# EAGLE schematic main (EAGLE 9.6.2)
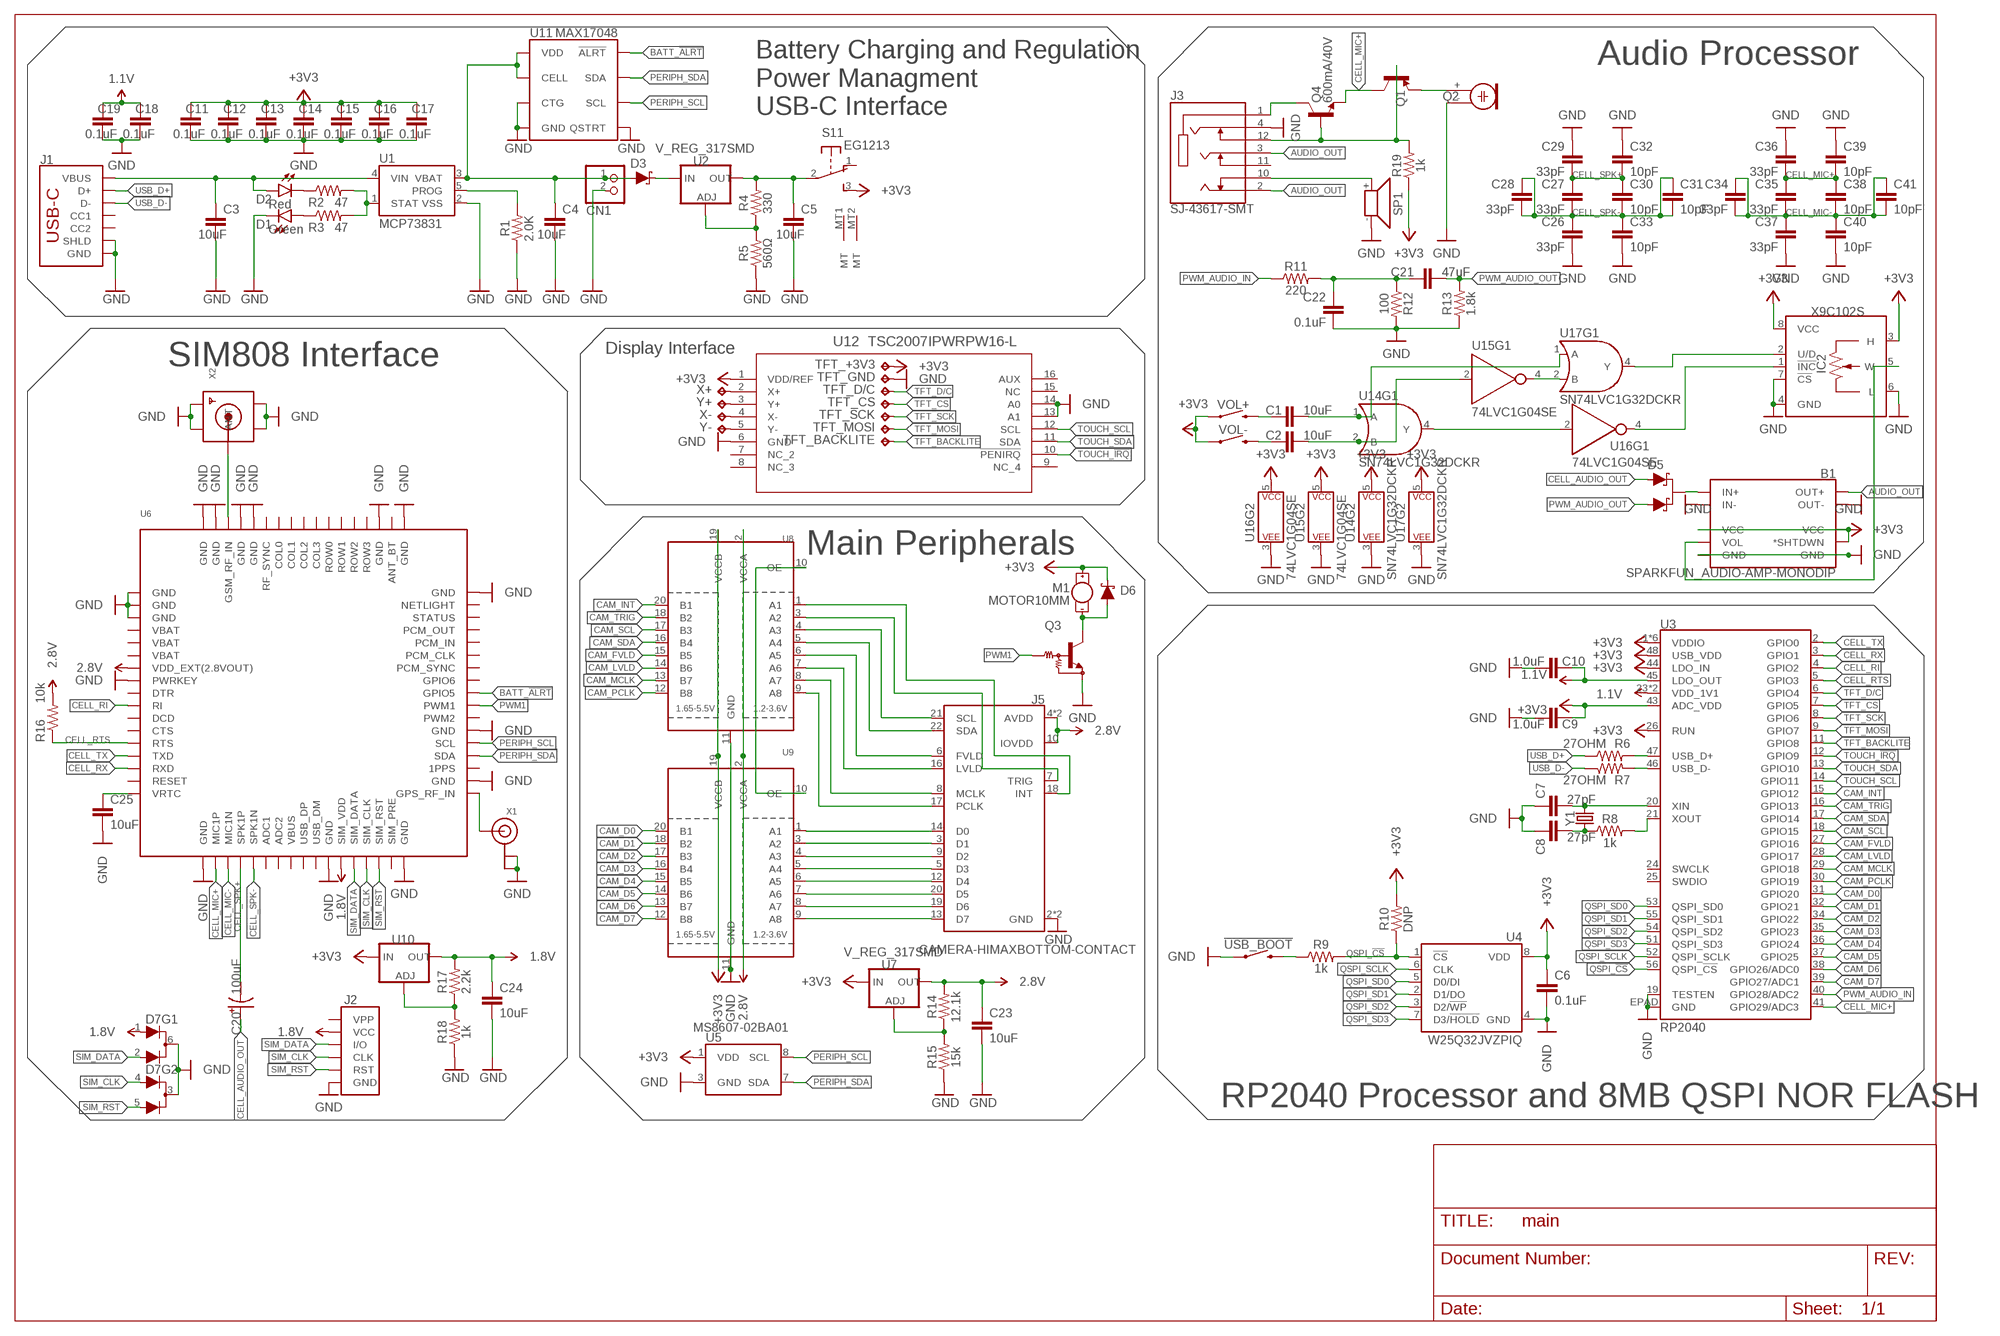
[diagram p0: schematic, sheet 1]

## Parts
!USB_BOOT  MOMENTARY-SWITCH-SPST-SMD-6.0X3.5MM  [TACTILE_SWITCH_SMD_6.0X3.5MM]
B1  SPARKFUN_AUDIO-AMP-MONODIP  [AUDIO-AMP-MONO]
C1  10uF  10UF-0402T-6.3V-20%  [0402-TIGHT]
C2  10uF  10UF-0402T-6.3V-20%  [0402-TIGHT]
C3  10uF  10UF-0402T-6.3V-20%  [0402-TIGHT]
C4  10uF  10UF-0402T-6.3V-20%  [0402-TIGHT]
C5  10uF  10UF-0402T-6.3V-20%  [0402-TIGHT]
C6  0.1uF  0.1UF-0402T-6.3V-10%-X7R  [0402-TIGHT]
C7  27pF  27PF-0402T-50V-5%  [0402-TIGHT]
C8  27pF  27PF-0402T-50V-5%  [0402-TIGHT]
C9  1.0uF  1.0UF-0402T-16V-10%  [0402-TIGHT]
C10  1.0uF  1.0UF-0402T-16V-10%  [0402-TIGHT]
C11  0.1uF  0.1UF-0402T-6.3V-10%-X7R  [0402-TIGHT]
C12  0.1uF  0.1UF-0402T-6.3V-10%-X7R  [0402-TIGHT]
C13  0.1uF  0.1UF-0402T-6.3V-10%-X7R  [0402-TIGHT]
C14  0.1uF  0.1UF-0402T-6.3V-10%-X7R  [0402-TIGHT]
C15  0.1uF  0.1UF-0402T-6.3V-10%-X7R  [0402-TIGHT]
C16  0.1uF  0.1UF-0402T-6.3V-10%-X7R  [0402-TIGHT]
C17  0.1uF  0.1UF-0402T-6.3V-10%-X7R  [0402-TIGHT]
C18  0.1uF  0.1UF-0402T-6.3V-10%-X7R  [0402-TIGHT]
C19  0.1uF  0.1UF-0402T-6.3V-10%-X7R  [0402-TIGHT]
C20  100uF  100UF-POLAR-1206-6.3V-20%(TANT)  [1206-POLAR]
C21  47uF  CAP-0402-TIGHT  [0402-TIGHT]
C22  0.1uF  0.1UF-0402T-6.3V-10%-X7R  [0402-TIGHT]
C23  10uF  10UF-0603-6.3V-20%  [0603]
C24  10uF  10UF-0402T-6.3V-20%  [0402-TIGHT]
C25  10uF  10UF-0603-6.3V-20%  [0603]
C26  33pF  33PF-0603-50V-5%  [0603]
C27  33pF  33PF-0603-50V-5%  [0603]
C28  33pF  33PF-0603-50V-5%  [0603]
C29  33pF  33PF-0603-50V-5%  [0603]
C30  10pF  10PF-0603-50V-5%  [0603]
C31  10pF  10PF-0603-50V-5%  [0603]
C32  10pF  10PF-0603-50V-5%  [0603]
C33  10pF  10PF-0603-50V-5%  [0603]
C34  33pF  33PF-0603-50V-5%  [0603]
C35  33pF  33PF-0603-50V-5%  [0603]
C36  33pF  33PF-0603-50V-5%  [0603]
C37  33pF  33PF-0603-50V-5%  [0603]
C38  10pF  10PF-0603-50V-5%  [0603]
C39  10pF  10PF-0603-50V-5%  [0603]
C40  10pF  10PF-0603-50V-5%  [0603]
C41  10pF  10PF-0603-50V-5%  [0603]
CN1  JST_2PIN-SMT-RA  [JST-PH-2-SMT-RA]
D1  Green  LED-GREEN-0603-WE  [LED-0603]
D2  Red  LED-RED-0603-WE  [LED-0603]
D3  3A/10V/280mV  DIODE-SCHOTTKY-BAT60A  [SOD-323]
D5  BAS70-05  DIODE-SCHOTTKY-DUAL  [SOT23-3]
D6  120mA/40V/370mV  DIODE-SCHOTTKY-RB751S40  [SOD-523]
D7  BAV70S,115  DIODE-DUAL  [SOT363]
IC2  X9C102S  [SOIC08]
J1  USB_C_2-LAYER_PADS  [USB-C-16P-2LAYER-PADS]
J2  SIMHOLDER-SIM  [SIMHOLDER]
J3  SJ-43617-SMT  [CUI_SJ-43617-SMT]
J5  CAMERA-HIMAXBOTTOM-CONTACT  [FPC-24-AMPHENOL-SFV24R-1STE1HLF]
M1  MOTOR10MM  [VIBE-MOTOR-10MM]
Q1  600mA/40V  TRANS_PNP-MMBT4403  [SOT23-3]
Q2  ELECTRET  [9.7ELECTRET]
Q3  TRANSISTOR-NPN_MUN2211  [TRANSISTOR-NPN_SC59-BEC]
Q4  600mA/40V  TRANS_NPN-MMBT2222AL  [SOT23-3]
R1  2.0K  2.0KOHM-0402T-1/16W-1%  [0402-TIGHT]
R2  47  47OHM-0402-TIGHT-1/16W-1%  [0402-TIGHT]
R3  47  47OHM-0402-TIGHT-1/16W-1%  [0402-TIGHT]
R4  330  330OHM-0402T-1/16W-5%  [0402-TIGHT]
R5  560Ω  560OHM_0402_TIGHT  [0402-TIGHT]
R6  27OHM  [0402-TIGHT]
R7  27OHM  [0402-TIGHT]
R8  1k  1KOHM-0402T-1/16W-1%  [0402-TIGHT]
R9  1k  1KOHM-0402T-1/16W-1%  [0402-TIGHT]
R10  DNP  DNP-0402T  [0402-TIGHT]
R11  220  220OHM-0402-TIGHT-1/16W-1%  [0402-TIGHT]
R12  100  100OHM-0402-TIGHT-1/16W-1%  [0402-TIGHT]
R13  1.8k  1.8KOHM-0603-1/10W-1%  [0603]
R14  12.1k  12.1KOHM-0603-1/10W-1%  [0603]
R15  15k  15KOHM-0603-1/10W-1%  [0603]
R16  10k  10KOHM-0402T-1/16W-1%  [0402-TIGHT]
R17  2.2k  2.2KOHM-0402T-1/16W-1%  [0402-TIGHT]
R18  1k  1KOHM-0402T-1/16W-1%  [0402-TIGHT]
R19  1k  1KOHM-0402T-1/16W-1%  [0402-TIGHT]
S1  EG1213  [EG1213]
SP1  SMS-1308MS-2-R  [SMS-1308MS-2-R]
TFT_+3V3  TPTP10R  [TP10R]
TFT_BACKLITE  TPTP10R  [TP10R]
TFT_CS  TPTP10R  [TP10R]
TFT_D/C  TPTP10R  [TP10R]
TFT_GND  TPTP10R  [TP10R]
TFT_MOSI  TPTP10R  [TP10R]
TFT_SCK  TPTP10R  [TP10R]
U1  MCP73831  [SOT23-5]
U2  V_REG_317SMD  [SOT223]
U3  RP2040  [QFN-56]
U4  W25Q32JVZPIQ  W25QXX32MBIT-6X5  [WSON-8-6X5]
U5  MS8607-02BA01  [MS8607-02BA01]
U6  GSM_SIM808_LITERAL  [SIM900_SMT]
U7  V_REG_317SMD  [SOT223]
U8  TXB0108PWR  [TSSOP20]
U9  TXB0108PWR  [TSSOP20]
U10  V_REG_317SMD  [SOT223]
U11  MAX17048  MAX17048DFN8  [DFN-8]
U12  TSC2007IPWRPW16-L  [PW16-L]
U14  SN74LVC1G32DCKR  7432  [SOT353]
U15  74LVC1G04SE  [SOT353]
U16  74LVC1G04SE  [SOT353]
U17  SN74LVC1G32DCKR  7432  [SOT353]
VOL+  MOMENTARY-SWITCH-SPST-PTH-RIGHT-ANGLE-8-020  [TACTILE_SWITCH_PTH_RA_8-020]
VOL-  MOMENTARY-SWITCH-SPST-PTH-RIGHT-ANGLE-8-020  [TACTILE_SWITCH_PTH_RA_8-020]
X1  ANTENNA_U.FL  [U.FL]
X2  SMACONNECTOR_EDGE  [SMA_EDGELAUNCH]
X+  TPTP10R  [TP10R]
X-  TPTP10R  [TP10R]
Y1  CRYSTAL-12MHZ  [CRYSTAL-SMD-2X2.5MM]
Y+  TPTP10R  [TP10R]
Y-  TPTP10R  [TP10R]

## Nets
1.1V: C10.1 C18.1 C19.1 U3.23(VDD_1V1) U3.45(LDO_OUT) U3.50(VDD_1V1)
1.8V: C24.1 D7.1(A1) J2.C1(VCC) R17.2 U6.P$29(SIM_VDD) U10.2(OUT)
2.8V: C23.1 J5.4(AVDD) J5.10(IOVDD) J5.11(AVDD) R14.2 R16.2 U6.P$7(VDD_EXT(2.8VOUT)) U7.2(OUT) U8.2(VCCA) U9.2(VCCA)
+3V3: B1.PWR+(VCC) B1.S(*SHTDWN) B1.VOL+(VCC) C6.1 C9.1 C11.1 C12.1 C13.1 C14.1 C15.1 C16.1 C17.1 D6.C IC2.3(H) IC2.8(VCC) M1.+ R10.2 R19.1 S1.3(1:S) TFT_+3V3.TP U3.1(VDDIO) U3.10(VDDIO) U3.22(VDDIO) U3.26(RUN) U3.33(VDDIO) U3.42(VDDIO) U3.43(ADC_VDD) U3.44(LDO_IN) U3.48(USB_VDD) U3.49(VDDIO) U4.8(VDD) U5.1(VDD) U7.3(IN) U8.19(VCCB) U9.19(VCCB) U10.3(IN) U12.1(VDD/REF) U14.5(P$V+) U15.5(P$V+) U16.5(P$V+) U17.5(P$V+) VOL+.1 VOL-.1
AUDIO_OUT: B1.OUT+ J3.2 J3.3
BATT_!ALRT: U6.P$43(GPIO5) U11.5(!ALRT)
CAM_D0: U3.31(GPIO20) U9.20(B1)
CAM_D1: U3.32(GPIO21) U9.18(B2)
CAM_D2: U3.34(GPIO22) U9.17(B3)
CAM_D3: U3.35(GPIO23) U9.16(B4)
CAM_D4: U3.36(GPIO24) U9.15(B5)
CAM_D5: U3.37(GPIO25) U9.14(B6)
CAM_D6: U3.38(GPIO26/ADC0) U9.13(B7)
CAM_D7: U3.39(GPIO27/ADC1) U9.12(B8)
CAM_FVLD: U3.27(GPIO16) U8.15(B5)
CAM_INT: U3.15(GPIO12) U8.20(B1)
CAM_LVLD: U3.28(GPIO17) U8.14(B6)
CAM_MCLK: U3.29(GPIO18) U8.13(B7)
CAM_PCLK: U3.30(GPIO19) U8.12(B8)
CAM_SCL: U3.18(GPIO15) U8.17(B3)
CAM_SDA: U3.17(GPIO14) U8.16(B4)
CAM_TRIG: U3.16(GPIO13) U8.18(B2)
CELL_AUDIO_OUT: C20.1(+) D5.1(A)
CELL_MIC+: C35.1 C36.2 C38.1 C39.2 Q1.3(C) Q4.2(E) U3.41(GPIO29/ADC3) U6.P$19(MIC1P)
CELL_MIC-: C34.1 C34.2 C35.2 C37.1 C38.2 C40.1 C41.1 C41.2 U6.P$20(MIC1N)
CELL_RI: U3.4(GPIO2) U6.P$10(RI)
CELL_RTS: R16.1 U3.5(GPIO3) U6.P$13(RTS)
CELL_RX: U3.3(GPIO1) U6.P$15(RXD)
CELL_SPK+: C20.2(-) C27.1 C29.2 C30.1 C32.2 U6.P$21(SPK1P)
CELL_SPK-: C26.1 C27.2 C28.1 C28.2 C30.2 C31.1 C31.2 C33.1 U6.P$22(SPK1N)
CELL_TX: U3.2(GPIO0) U6.P$14(TXD)
GND: !USB_BOOT.1 B1.IN- B1.OUT- B1.PWR-(GND) B1.VOL-(GND) C3.2 C4.2 C5.2 C6.2 C7.1 C8.1 C9.2 C10.2 C11.2 C12.2 C13.2 C14.2 C15.2 C16.2 C17.2 C18.2 C19.2 C22.2 C23.2 C24.2 C25.2 C26.2 C29.1 C32.1 C33.2 C36.1 C37.2 C39.1 C40.2 CN1.2 D1.C D7.3(C) D7.6(C) IC2.4(GND) IC2.6(L) IC2.7(!CS) J1.GND J1.GND2(GND) J1.SHLD1(SHLD) J1.SHLD2(SHLD) J1.SHLD3(SHLD) J1.SHLD4(SHLD) J2.C5(GND) J3.4 J5.2(GND) J5.15(GND) Q2.- Q3.E R1.1 R5.1 R12.2 R13.1 R15.1 R18.1 SP1.- TFT_GND.TP U1.2(VSS) U3.19(TESTEN) U3.EPAD(GND) U4.4(GND) U5.3(GND) U6.P$1(GND) U6.P$2(GND) U6.P$3(GND) U6.P$8(PWRKEY) U6.P$18(GND) U6.P$28(GND) U6.P$34(GND) U6.P$36(GND) U6.P$40(GND) U6.P$51(GND) U6.P$52(GND) U6.P$54(GND) U6.P$64(GND) U6.P$65(GND) U6.P$67(GND) U6.P$68(GND) U8.11(GND) U9.11(GND) U11.1(CTG) U11.4(GND) U11.6(QSTRT) U11.9(GND) U12.6(GND) U12.13(A1) U12.14(A0) U14.3(P$V-) U15.3(P$V-) U16.3(P$V-) U17.3(P$V-) X1.1(GND) X1.2(GND) X2.GND@1(GND4) X2.GND@2(GND3) X2.GND@3(GND2) X2.GND@4(GND1)
N$1: C5.1 R4.2 S1.2(1:P) U2.2(OUT)
N$2: C1.2 U14.1(A) U17.1(A)
N$3: C2.2 U14.2(B) U15.2(A)
N$4: C3.1 D2.A J1.VBUS1(VBUS) J1.VBUS2(VBUS) U1.4(VIN)
N$5: R2.2 R3.2 U1.1(STAT)
N$6: D2.C R2.1
N$7: D1.A R3.1
N$8: R1.2 U1.5(PROG)
N$9: U15.4(Y) U17.2(B)
N$10: D3.C U2.3(IN)
N$11: R4.1 R5.2 U2.1(ADJ)
N$12: C1.1 VOL+.2
N$13: U14.4(Y) U16.2(A)
N$14: R6.2 U3.47(USB_D+)
N$15: R7.2 U3.46(USB_D-)
N$16: R8.2 U3.21(XOUT)
N$17: C7.2 U3.20(XIN) Y1.P3
N$18: C8.2 R8.1 Y1.P1
N$19: !USB_BOOT.2 R9.1
N$20: J5.14(D0) U9.1(A1)
N$21: J5.3(D1) U9.3(A2)
N$22: J3.10 SP1.+
N$23: C21.1 C22.1 R11.2 R12.1
N$24: B1.IN+ D5.3(C)
N$25: R14.1 R15.2 U7.1(ADJ)
N$26: J5.9(D2) U9.4(A3)
N$27: U8.10(OE) U9.10(OE)
N$28: J5.5(D3) U9.5(A4)
N$29: J5.20(D5) U9.7(A6)
N$30: J5.12(D4) U9.6(A5)
N$31: J5.19(D6) U9.8(A7)
N$32: J5.13(D7) U9.9(A8)
N$33: J5.17(PCLK) U8.9(A8)
N$34: J5.8(MCLK) U8.8(A7)
N$35: J5.16(LVLD) U8.7(A6)
N$36: J5.6(FVLD) U8.6(A5)
N$37: J5.22(SDA) U8.5(A4)
N$38: J5.21(SCL) U8.4(A3)
N$39: J5.7(TRIG) U8.3(A2)
N$40: J5.18(INT) U8.1(A1)
N$41: U6.P$35(GPS_RF_IN) X1.3(SIGNAL)
N$42: D6.A M1.- Q3.C
N$43: C4.1 CN1.1 D3.A U1.3(VBAT) U11.2(CELL) U11.3(VDD)
N$44: IC2.2(U/D) U17.4(Y)
N$45: U6.P$66(GSM_RF_IN) X2.P(ANT)
N$46: R17.1 R18.2 U10.1(ADJ)
N$47: C25.1 U6.P$17(VRTC)
N$48: Q1.2(E) Q2.+
N$49: IC2.1(!INC) U16.4(Y)
N$50: C2.1 VOL-.2
N$51: B1.VOL IC2.5(W)
N$52: U12.2(X+) X+.TP
N$53: U12.3(Y+) Y+.TP
N$54: U12.4(X-) X-.TP
N$55: U12.5(Y-) Y-.TP
N$56: J3.12 Q1.1(B) Q4.1(B) R19.2
N$57: J3.1 Q4.3(C)
PERIPH_SCL: U5.8(SCL) U6.P$39(SCL) U11.7(SCL)
PERIPH_SDA: U5.7(SDA) U6.P$38(SDA) U11.8(SDA)
PWM1: Q3.B U6.P$42(PWM1)
PWM_AUDIO_IN: R11.1 U3.40(GPIO28/ADC2)
PWM_AUDIO_OUT: C21.2 D5.2(A1) R13.2
QSPI_!CS: R9.2 R10.1 U3.56(QSPI_!CS!) U4.1(!CS!)
QSPI_SCLK: U3.52(QSPI_SCLK) U4.6(CLK)
QSPI_SD0: U3.53(QSPI_SD0) U4.5(D0/DI)
QSPI_SD1: U3.55(QSPI_SD1) U4.2(D1/DO)
QSPI_SD2: U3.54(QSPI_SD2) U4.3(D2/!WP!)
QSPI_SD3: U3.51(QSPI_SD3) U4.7(D3/!HOLD!)
SIM_CLK: D7.4(A1) J2.C3(CLK) U6.P$31(SIM_CLK)
SIM_DATA: D7.2(A2) J2.C7(I/O) U6.P$30(SIM_DATA)
SIM_RST: D7.5(A2) J2.C2(RST) U6.P$32(SIM_RST)
TFT_BACKLITE: TFT_BACKLITE.TP U3.11(GPIO8)
TFT_CS: TFT_CS.TP U3.7(GPIO5)
TFT_D/C: TFT_D/C.TP U3.6(GPIO4)
TFT_MOSI: TFT_MOSI.TP U3.9(GPIO7)
TFT_SCK: TFT_SCK.TP U3.8(GPIO6)
TOUCH_!IRQ: U3.12(GPIO9) U12.10(!PENIRQ)
TOUCH_SCL: U3.14(GPIO11) U12.12(SCL)
TOUCH_SDA: U3.13(GPIO10) U12.11(SDA)
USB_D+: J1.A6(D+) J1.B6(D+) R6.1
USB_D-: J1.A7(D-) J1.B7(D-) R7.1
Unconnected: J1.A5(CC1) J1.B5(CC2) J2.C6(VPP) J3.11 J5.MNT1@0(MNT1) J5.MNT1@1(MNT1) J5.MNT2@0(MNT2) J5.MNT2@1(MNT2) S1.1(1:O) S1.MT1(MT) S1.MT2(MT) U3.24(SWCLK) U3.25(SWDIO) U6.P$9(DTR) U6.P$11(DCD) U6.P$12(CTS) U6.P$16(RESET) U6.P$23(ADC1) U6.P$24(ADC2) U6.P$26(USB_DP) U6.P$27(USB_DM) U6.P$33(SIM_PRE) U6.P$37(1PPS) U6.P$41(PWM2) U6.P$44(GPIO6) U6.P$45(PCM_SYNC) U6.P$46(PCM_CLK) U6.P$47(PCM_IN) U6.P$48(PCM_OUT) U6.P$49(STATUS) U6.P$50(NETLIGHT) U6.P$53(ANT_BT) U6.P$55(ROW3) U6.P$56(ROW2) U6.P$57(ROW1) U6.P$58(ROW0) U6.P$59(COL3) U6.P$60(COL2) U6.P$61(COL1) U6.P$62(COL0) U6.P$63(RF_SYNC) U12.7(NC_2) U12.8(NC_3) U12.9(NC_4) U12.15(NC) U12.16(AUX)

## Notes on the sheet
- Audio Processor
- Battery Charging and Regulation
  Power Managment
  USB-C Interface
- SIM808 Interface
- Display Interface
- Main Peripherals
- RP2040 Processor and 8MB QSPI NOR FLASH

## Power pins joined to a net without a drawn wire
VBAT: U6.P$4(VBAT) U6.P$5(VBAT) U6.P$6(VBAT)
VBUS: U6.P$25(VBUS)

## Library data of the parts
!USB_BOOT = SparkFun-Switches:MOMENTARY-SWITCH-SPST: Momentary Switch (Pushbutton) - SPST Normally-open (NO) SPST momentary switches (buttons, pushbuttons). Variants PTH-12MM - 12mm square, through-hole Momentary Pushbutton Switch - 12mm Square <https://www.sparkfun.com/products/9190> (COM-09190) PTH-6.0MM, PTH-6.0MM-KIT - 6.0mm square, through-hole Mini Pushbutton Switch <https://www.sparkfun.com/products/97> (COM-00097) KIT package intended for soldering kit's - only one side of pads' copper is exposed. PTH-RIGHT-ANGLE-KIT - Right-angle, through-hole Right Angle Tactile Button <https://www.sparkfun.com/products/10791> - Used on SparkFun BigTime Watch Kit <https://www.sparkfun.com/products/11734> SMD-12MM - 12mm square, surface-mount Tactile Button - SMD (12mm) <https://www.sparkfun.com/products/12993> (COM-12993) Used on SparkFun PicoBoard <https://www.sparkfun.com/products/11888> SMD-4.5MM - 4.5mm Square Trackball Switch Used on SparkFun Blackberry Trackballer Breakout <https://www.sparkfun.com/products/13169> SMD-4.6MMX2.8MM - 4.60mm x 2.80mm, surface mount Used on SparkFun Pro Micro - RP2040 <https://www.sparkfun.com/products/17717> SMD-5.2MM, SMD-5.2-REDUNDANT - 5.2mm square, surface-mount Mini Pushbutton Switch - SMD <https://www.sparkfun.com/products/8720> (COM-08720) Used on Arduino Pro Mini <https://www.sparkfun.com/products/11114> REDUNDANT package connects both switch circuits together SMD-6.0X3.5MM - 6.0 x 3.5mm, surface mount Momentary Reset Switch SMD <https://www.sparkfun.com/products/8229> (COM-08229) SMD-6.2MM-TALL - 6.2mm square, surface mount Tactile Button - SMD (6mm) <https://www.sparkfun.com/products/12992> Used on SparkFun Digital Sandbox <https://www.sparkfun.com/products/12651> SMD-RIGHT-ANGLE - Right-angle, surface mount Used on SparkFun Block for Intel® Edison - Arduino <https://www.sparkfun.com/products/13036>; PROD_ID: SWCH-14278; SF_SKU: COM-08229
B1 = SparkFun-Boards:SPARKFUN_AUDIO-AMP-MONO: SparkFun Mono Audio Amp Breakout- TPA2005D1 This tiny audio amplifier is based on the Texas Instruments TPA2005D1. Its efficient class-D operation means low heat and long battery life. It can drive an 8-Ohm speaker at up to 1.4 Watts SparkFun Products: Mono Audio Amp Breakout <https://www.sparkfun.com/products/11044>
C1-C5 C24 = SparkFun-Capacitors:10UF: 10.0µF ceramic capacitors A capacitor is a passive two-terminal electrical component used to store electrical energy temporarily in an electric field.; PROD_ID: CAP-14848
C6 C11-C19 C22 = SparkFun-Capacitors:0.1UF: 0.1µF ceramic capacitors A capacitor is a passive two-terminal electrical component used to store electrical energy temporarily in an electric field.; PROD_ID: CAP-14993
C7 C8 = SparkFun-Capacitors:27PF: 27pF ceramic capacitors A capacitor is a passive two-terminal electrical component used to store electrical energy temporarily in an electric field.; PROD_ID: CAP-15357
C9 C10 = SparkFun-Capacitors:1.0UF: 1µF ceramic capacitors A capacitor is a passive two-terminal electrical component used to store electrical energy temporarily in an electric field.; PROD_ID: CAP-12417
C20 = SparkFun-Capacitors:100UF-POLAR: 100µF polarized capacitors A capacitor is a passive two-terminal electrical component used to store electrical energy temporarily in an electric field.; PROD_ID: CAP-14093
C21 = SparkFun-Capacitors:CAP
C23 C25 = SparkFun-Capacitors:10UF: 10.0µF ceramic capacitors A capacitor is a passive two-terminal electrical component used to store electrical energy temporarily in an electric field.; PROD_ID: CAP-11015
C26-C29 C34-C37 = SparkFun-Capacitors:33PF: 33pF ceramic capacitors A capacitor is a passive two-terminal electrical component used to store electrical energy temporarily in an electric field.; PROD_ID: CAP-10142
C30-C33 C38-C41 = SparkFun-Capacitors:10PF: 10pF ceramic capacitors A capacitor is a passive two-terminal electrical component used to store electrical energy temporarily in an electric field.; PROD_ID: CAP-11812
CN1 = adafruit:JST_2PIN: JST 2-Pin Connectors of various flavors SMT-RA (S2B-PH-SM4) 4UConnector #17311 SMT (B2B-PH-SM4) THM-RA (S2B-PH) THM (B2B-PH)
D1 = SparkFun-LED:LED-GREEN: Green SMD LED Used in manufacturing of various products at SparkFun Packages: 0603 - SMD 0603 package [Product Link] <http://www.futureelectronics.com/en/technologies/semiconductors/optoelectronics/leds/Pages/9894312-LTST-C190GKT.aspx?CrossPart=HSMG-C190&IM=0> LilyPad 1206 - SMD1206 LilyPad package [Product Link] <http://www.futureelectronics.com/en/Technologies/Product.aspx?ProductID=IN150NGHARVATEKCORPORATION2049943&IM=0> 1206 - SMD1206 package [Product Link] <http://www.futureelectronics.com/en/technologies/semiconductors/optoelectronics/leds/Pages/8315665-LTST-C150KGKT.aspx?IM=0> 1206 Bottom Mount -SMD 1206 Bottom Mount [Product Link] <http://www.digikey.com/product-detail/en/lite-on-inc/LTST-C230KGKT/160-1456-1-ND/386854> SparkFun Products: Pro Mini 328 -5V <https://www.sparkfun.com/products/821> RedBoard <https://www.sparkfun.com/products/12757> MP3 Trigger <https://www.sparkfun.com/products/13720> Makey Makey <https://www.sparkfun.com/products/11076>; PROD_ID: DIO-16512
D2 = SparkFun-LED:LED-RED: Red SMD LED Used in manufacturing of most products at SparkFun Packages: 0603 - KB - KingBright (DIO-17976) SMD 0603 package [Datasheet] <https://www.kingbrightusa.com/images/catalog/SPEC/APT1608SURCK.pdf> 0603 - (DIO-00819, has gone EOL) SMD 0603 package 0603 SMART - SMD 0603 SMART package ( more efficient and expensive)[Product Link] <http://www.osram-os.com/Graphics/XPic2/00077099_0.pdf> 1206 - SMD1206 package [Product Link] <https://www.sparkfun.com/datasheets/DevTools/LilyPad/Q150OVS4.pdff> SparkFun Products: Pro Mini 328 -5V <https://www.sparkfun.com/products/821> RedBoard <https://www.sparkfun.com/products/12757> IOIO-OTG <https://www.sparkfun.com/products/13613>; PROD_ID: DIO-16511
D3 = SparkFun-DiscreteSemi:DIODE-SCHOTTKY: Schottky diode A Schottky diode is a semiconductor diode which has a low forward voltage drop and a very fast switching action.; PROD_ID: DIO-14072
D5 = SparkFun-DiscreteSemi:DIODE-SCHOTTKY-DUAL: Diodes Incorporated - BAS70-05 Dual Schottky Diode Two Schottky Diodes in a single SOT-23 package. Low reverse current (100 nA) Vf: Datasheet referenced for footprint <https://www.diodes.com/assets/Datasheets/ds11007.pdf>; PROD_ID: DIO-14829
D6 = SparkFun-DiscreteSemi:DIODE-SCHOTTKY: Schottky diode A Schottky diode is a semiconductor diode which has a low forward voltage drop and a very fast switching action.; PROD_ID: DIO-11018
D7 = SparkFun-DiscreteSemi:DIODE-DUAL; PROD_ID: DIO-15412
IC2 = pot-xicor:X9C102*: Digital POTENTIOMETER; MF: INTERSIL; MPN: X9C102SIZ; OC_FARNELL: 1562072; OC_NEWARK: 79K8947
J1 = SparkFun-Connectors:USB_C: USB Type C 16Pin Connector Super Speed pins not available on the 16-pin purely SMD connector so this part is best for USB 2.0 implementations. D1 and D2 are tied together enabling D+/- no matter which way the cable is plugged into the connector. The two channel configuration pins (CC1/2) are exposed. These are normally connected to ground via 5.1k resistors but can be reconfigured for high current/high power applications. **4-LAYER BOARD WARNING!!** If designing 4-layer board, make sure to select the variant _4-LAYER-ISOLATED. The linked footprint (USB-C-16-4LAYER-ISOLATED) includes some very necessary cutout polygons in the inner layers (2 and 15). This prevents the PTH mounting shield legs on the USB connector from electrically connecting any other polygons on the inner layers (usually VCC and GND).; PROD_ID: CONN-14122
J2 = SparkFun-Connectors:SIMHOLDER: SIM Cellular Card Socket SMT 6 pin standard connection. SparkFun Products: SIM Socket <https://www.sparkfun.com/products/548> SparkFun Cellular Shield - MG2639 <https://www.sparkfun.com/products/13120> SparkFun SIM Card Socket Breakout <https://www.sparkfun.com/products/573>; PROD_ID: CONN-08536; SF_ID: PRT-00548
J3 = SJ-43617-SMT:SJ-43617-SMT: 4 Conductor 3.5 mm Mid Mount SMT Audio Jack w/ Three Switches Check availability <https://pricing.snapeda.com/parts/SJ-43617-SMT-TR/CUI%20Devices/view-part?ref=eda>; AVAILABILITY: In Stock; CUI_PURCHASE_URL: https://www.cuidevices.com/product/interconnect/connectors/audio-connectors/jacks/sj-4361x-smt-series?utm_source=snapeda.com&utm_medium=referral&utm_campaign=snapedaBOM; DESCRIPTION: 3.5 mm, Right Angle, Mid Mount (SMT), 4 Conductors, 0~1 Internal Switches, Audio Jack Connector; MF: CUI Devices; MP: SJ-43617-SMT-TR; PACKAGE: None; PRICE: None; PURCHASE-URL: https://pricing.snapeda.com/search/part/SJ-43617-SMT-TR/?ref=eda
J5 = SparkFun-Connectors:CAMERA-HIMAX; DIGIKEY: 609-4320-2-ND; PROD_ID: CONN-14233
M1 = SparkFun-Electromechanical:MOTOR: Motor (Single-Phase) Two-terminal, single-phase motors. SparkFun Products Vibration Motor <https://www.sparkfun.com/products/8449> (ROB-08449) Physical dimension and wire connections for this powerful vibration motor. Motor has a self adhesive backing.; PROD_ID: COMP-08572; SF_SKU: ROB-08449
Q1 = SparkFun-DiscreteSemi:TRANS_PNP: PNP transistor Current controlled devices typically used to amplify current or used as a switch. SparkFun Products: SparkFun Serial Enabled 16x2 LCD - Red on Black <https://www.sparkfun.com/products/9068> SparkFun Logomatic <https://www.sparkfun.com/products/12772>; PROD_ID: TRANS-09245
Q2 = adafruit:ELECTRET: Electret microphone Thru hole 2.54mm spacing with 9.7mm diameter
Q3 = 52101-101-REV-A_v16:TRANSISTOR-NPN_MUN2211*: NPN Bias Resistor Transistor
Q4 = SparkFun-DiscreteSemi:TRANS_NPN: NPN transistor Current controlled devices typically used to amplify current or used as a switch. BC547 - COM-08928 <http://www.sparkfun.com/products/8928> (TO-92 45V 100mA) (1.Collector 2.Base 3.Emitter) 2N3904 - COM-00521 <http://www.sparkfun.com/products/521> (TO-92 40V 200mA) (1.Emitter 2.Base 3.Collector) P2N2222A - COM-12852 <http://www.sparkfun.com/products/12852> (TO-92 40V 600mA) (1.Collector 2.Base 3.Emitter); PROD_ID: TRANS-08049
R1 = SparkFun-Resistors:2.0KOHM: 2kΩ resistor A resistor is a passive two-terminal electrical component that implements electrical resistance as a circuit element. Resistors act to reduce current flow, and, at the same time, act to lower voltage levels within circuits. - Wikipedia; PROD_ID: RES-15406
R2 R3 = SparkFun-Resistors:47OHM: 47Ω resistor A resistor is a passive two-terminal electrical component that implements electrical resistance as a circuit element. Resistors act to reduce current flow, and, at the same time, act to lower voltage levels within circuits. - Wikipedia; PROD_ID: RES-15585
R4 = SparkFun-Resistors:330OHM: 330Ω resistor A resistor is a passive two-terminal electrical component that implements electrical resistance as a circuit element. Resistors act to reduce current flow, and, at the same time, act to lower voltage levels within circuits. - Wikipedia; PROD_ID: RES-15407
R5 = SparkFun-Resistors:560OHM; PROD_ID: RES-13766
R6 R7 = SparkFun-Resistors:27OHM: 27Ω resistor A resistor is a passive two-terminal electrical component that implements electrical resistance as a circuit element. Resistors act to reduce current flow, and, at the same time, act to lower voltage levels within circuits. - Wikipedia; PROD_ID: RES-15238
R8 R9 R18 R19 = SparkFun-Resistors:1KOHM: 1kΩ resistor A resistor is a passive two-terminal electrical component that implements electrical resistance as a circuit element. Resistors act to reduce current flow, and, at the same time, act to lower voltage levels within circuits. - Wikipedia; PROD_ID: RES-14342
R10 = SparkFun-Resistors:DNP: Do-Not-Populate resistor A resistor is a passive two-terminal electrical component that implements electrical resistance as a circuit element. Resistors act to reduce current flow, and, at the same time, act to lower voltage levels within circuits. - Wikipedia
R11 = SparkFun-Resistors:220OHM: 220Ω resistor A resistor is a passive two-terminal electrical component that implements electrical resistance as a circuit element. Resistors act to reduce current flow, and, at the same time, act to lower voltage levels within circuits. - Wikipedia; PROD_ID: RES-15269
R12 = SparkFun-Resistors:100OHM: 100Ω resistor A resistor is a passive two-terminal electrical component that implements electrical resistance as a circuit element. Resistors act to reduce current flow, and, at the same time, act to lower voltage levels within circuits. - Wikipedia; PROD_ID: RES-14962
R13 = SparkFun-Resistors:1.8KOHM: 1.8kΩ resistor A resistor is a passive two-terminal electrical component that implements electrical resistance as a circuit element. Resistors act to reduce current flow, and, at the same time, act to lower voltage levels within circuits. - Wikipedia; PROD_ID: RES-09119
R14 = SparkFun-Resistors:12.1KOHM: 12.1kΩ resistor A resistor is a passive two-terminal electrical component that implements electrical resistance as a circuit element. Resistors act to reduce current flow, and, at the same time, act to lower voltage levels within circuits. - Wikipedia; PROD_ID: RES-09378
R15 = SparkFun-Resistors:15KOHM: 15kΩ resistor A resistor is a passive two-terminal electrical component that implements electrical resistance as a circuit element. Resistors act to reduce current flow, and, at the same time, act to lower voltage levels within circuits. - Wikipedia; PROD_ID: RES-07854
R16 = SparkFun-Resistors:10KOHM: 10kΩ resistor A resistor is a passive two-terminal electrical component that implements electrical resistance as a circuit element. Resistors act to reduce current flow, and, at the same time, act to lower voltage levels within circuits. - Wikipedia; PROD_ID: RES-14241
R17 = SparkFun-Resistors:2.2KOHM: 2.2kΩ resistor A resistor is a passive two-terminal electrical component that implements electrical resistance as a circuit element. Resistors act to reduce current flow, and, at the same time, act to lower voltage levels within circuits. - Wikipedia; PROD_ID: RES-14341
S1 = adafruit:EG1213: E-Switch right-angle slide SPDT Part #EG1213 http://www.ladyada.net/library/eagle
SP1 = speaker:SMS-1308MS-2-R: Speaker 13 x 13mm, 8 Ohm, 0.7W Source: pui audio inc. SMS-1308MS-2-R.pdf
TFT_+3V3 TFT_BACKLITE TFT_CS TFT_D/C TFT_GND TFT_MOSI TFT_SCK X+ X- Y+ Y- = BeagleBone_Blue_R3:TP: Test pad
U1 = SparkFun-IC-Power:MCP73831: MCP73831T Li-Ion, Li-Pol Controller Miniature single cell, fully integrated Li-Ion, Li-polymer charge management controller Datasheet <http://ww1.microchip.com/downloads/en/DeviceDoc/20001984g.pdf> SparkFun Products: SparkFun ESP32 Thing <https://www.sparkfun.com/products/13907> SparkFun 9DoF Razor IMU M0 <https://www.sparkfun.com/products/14001>; PROD_ID: IC-09995
U2 U7 U10 = SparkFun-IC-Power:V_REG_317: Voltage Regulator Standard LM317 adjustable voltage regulator. AOI (Adjust Output Input). Google 'LM317 Calculator' for easy to use app to get the two resistor values needed. 240/720 for 5V output. 240/390 for 3.3V output. Spark Fun Electronics SKU : COM-00527
U3 = SparkFun-IC-Microcontroller:RP2040: Raspberry Pi RP2040 MCU 56-pin 32-bit Microcontroller with 264kB of SRAM and external flash support up to 16MB Getting Started with the RP2040 <https://pico.raspberrypi.org/getting-started/> Dual-core ARM Cortex M0+ processor, flexible clock running up to 133 MHz 264kB of SRAM, and QSPI control of common flash memory USB 1.1 Host and Device support Low-power sleep and dormant modes Drag & drop programming using mass storage over USB 26 multi-function GPIO pins 2×SPI, 2×I2C, 2×UART, 3×12-bit ADC, 16×controllable PWM channels Accurate clock and timer on-chip Temperature sensor Accelerated floating point libraries on-chip 8×Programmable IO (PIO) state machines for custom peripheral support; PROD_ID: IC-15502
U4 = SparkFun-IC-Memory:W25QXX; PROD_ID: IC-15681
U5 = SparkFun-Sensors:MS8607-02BA01: PHT Combination Sensor Source: Datasheet <http://www.te.com/commerce/DocumentDelivery/DDEController?Action=showdoc&DocId=Data SheetMS8607-02BA01BpdfEnglishENG_DS_MS8607-02BA01_B.pdfCAT-BLPS0018>; PROD_ID: IC-15048
U6 = adafruit:GSM_SIM808_LITERAL: SIM808 GSM Module
U8 U9 = adafruit:TXB0108PWR: 8-Bit Bi-Directional Level Shifter 1.2V-3.6V (VCCA) to 1.65V-5.5V (VCCB) bi-directional level shifter with auto direction sensing. Max data rate - VCCA 1.8V: 20Mbps (50ns), VCCA 3.3V: 100Mbps (10ns) Digikey: 296-21527-1-ND
U11 = SparkFun-IC-Power:MAX17048: Micropower 1-Cell Li+ ModelGauge SparkFun Products Qduino Mini <https://www.sparkfun.com/products/13614> (DEV-13614); PROD_ID: IC-12551
U12 = ultra_librarian_parts:TSC2007IPWR; COPYRIGHT: Copyright (C) 2023 Ultra Librarian. All rights reserved.; MANUFACTURER_PART_NUMBER: TSC2007IPWR; MFR_NAME: Texas Instruments
U14 U17 = SparkFun-IC-Logic:74*32: Single OR gate IC POSITIVE-OR GATE 2-IN SC-70 SparkFun Products SparkFun Stepoko <https://www.sparkfun.com/products/13899> (ROB-13899) SparkFun LogicBlocks Kit <https://www.sparkfun.com/products/11006> (KIT-11006); PROD_ID: IC-10842
U15 U16 = SparkFun-IC-Logic:74*1G04: Single Inverter IC NOT GATE INVERTER SNGL 1IN SOT353 Supply: 1.65V to 5.5V Datasheet <http://diodes.com/datasheets/74LVC1G04.pdf> SparkFun Products SparkFun Stepoko <https://www.sparkfun.com/products/13899> (ROB-13899) SparkFun CryptoShield <https://www.sparkfun.com/products/13183> (DEV-13183) SparkFun LogicBlocks Kit <https://www.sparkfun.com/products/11006> (KIT-11006) SparkFun ArduMoto <https://www.sparkfun.com/products/9815> (DEV-09815); PROD_ID: IC-10843
VOL+ VOL- = SparkFun-Switches:MOMENTARY-SWITCH-SPST: Momentary Switch (Pushbutton) - SPST Normally-open (NO) SPST momentary switches (buttons, pushbuttons). Variants PTH-12MM - 12mm square, through-hole Momentary Pushbutton Switch - 12mm Square <https://www.sparkfun.com/products/9190> (COM-09190) PTH-6.0MM, PTH-6.0MM-KIT - 6.0mm square, through-hole Mini Pushbutton Switch <https://www.sparkfun.com/products/97> (COM-00097) KIT package intended for soldering kit's - only one side of pads' copper is exposed. PTH-RIGHT-ANGLE-KIT - Right-angle, through-hole Right Angle Tactile Button <https://www.sparkfun.com/products/10791> - Used on SparkFun BigTime Watch Kit <https://www.sparkfun.com/products/11734> SMD-12MM - 12mm square, surface-mount Tactile Button - SMD (12mm) <https://www.sparkfun.com/products/12993> (COM-12993) Used on SparkFun PicoBoard <https://www.sparkfun.com/products/11888> SMD-4.5MM - 4.5mm Square Trackball Switch Used on SparkFun Blackberry Trackballer Breakout <https://www.sparkfun.com/products/13169> SMD-4.6MMX2.8MM - 4.60mm x 2.80mm, surface mount Used on SparkFun Pro Micro - RP2040 <https://www.sparkfun.com/products/17717> SMD-5.2MM, SMD-5.2-REDUNDANT - 5.2mm square, surface-mount Mini Pushbutton Switch - SMD <https://www.sparkfun.com/products/8720> (COM-08720) Used on Arduino Pro Mini <https://www.sparkfun.com/products/11114> REDUNDANT package connects both switch circuits together SMD-6.0X3.5MM - 6.0 x 3.5mm, surface mount Momentary Reset Switch SMD <https://www.sparkfun.com/products/8229> (COM-08229) SMD-6.2MM-TALL - 6.2mm square, surface mount Tactile Button - SMD (6mm) <https://www.sparkfun.com/products/12992> Used on SparkFun Digital Sandbox <https://www.sparkfun.com/products/12651> SMD-RIGHT-ANGLE - Right-angle, surface mount Used on SparkFun Block for Intel® Edison - Arduino <https://www.sparkfun.com/products/13036>; PROD_ID: SWCH-13896
X1 = adafruit:ANTENNA_U.FL: U.FL Antenna Connector
X2 = adafruit:SMACONNECTOR: SMA Connector 90° DIP SMA Connector, 50 Ohm (4UConnector: 07259)
Y1 = SparkFun-Clocks:CRYSTAL-12MHZ: 12.0MHz Crystal Frequency: 12.0MHz Frequency Tolerance: ±20ppm Load Capacitance: 18pF SparkFun Products: SparkFun Logomatic <https://www.sparkfun.com/products/12772> Pocket AVR Programmer <https://www.sparkfun.com/products/9825>; PROD_ID: XTAL-15540